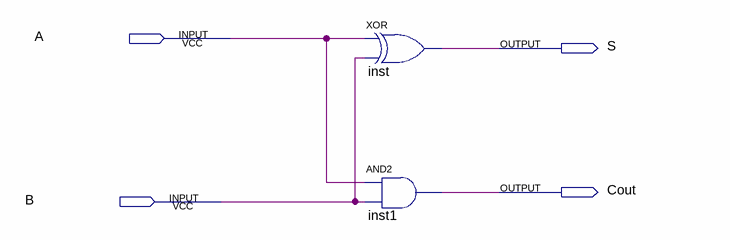
[diagram p0: schematic sheet]
// Quartus schematic DSLab1.bdf as structural Verilog: 2 symbols, 4 pins
module DSLab1 (
  input  A,
  input  B,
  output S,
  output Cout
);

  xor inst (S, A, B);
  and inst1 (Cout, A, B);
endmodule
